# EAGLE design D1-Nixi-IN-16-V2-lapos (EAGLE 6.3)
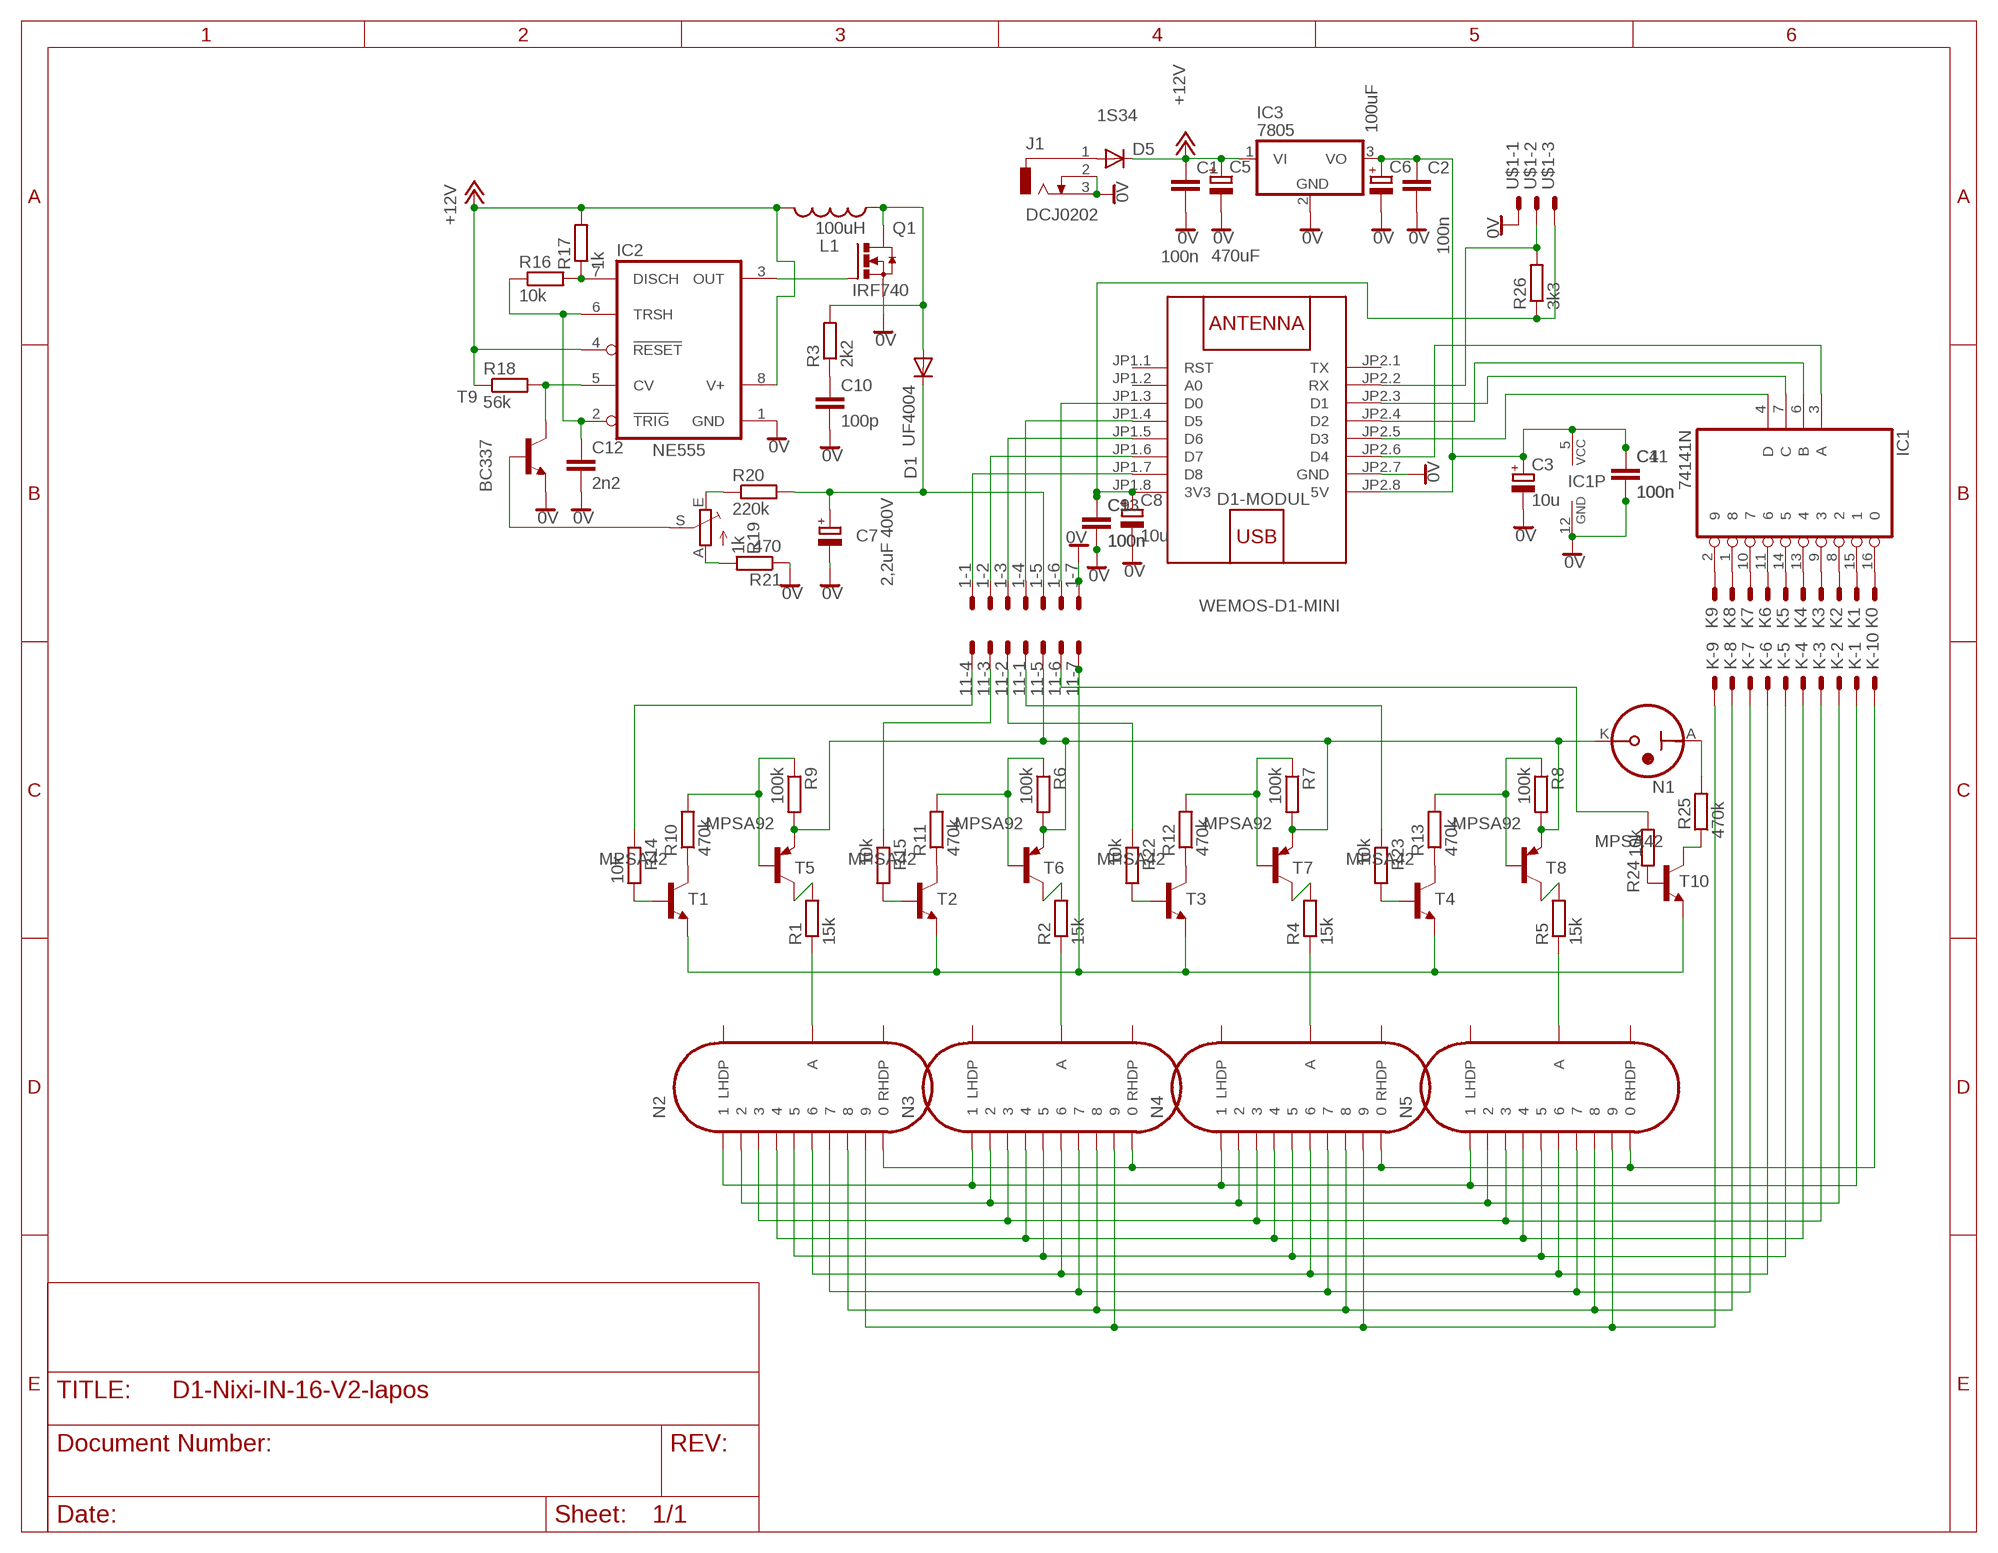
[diagram p0: schematic, sheet 1]

## Parts
1  PAD7  [PAD7]
11  PAD7  [PAD7]
C1  100n  C-EUC0603  [C0603]
C2  100n  C-EUC0603  [C0603]
C3  10u  CPOL-EUE2,5-6E  [E2,5-6E]
C4  100n  C-EUC0603  [C0603]
C5  470uF  CPOL-EUE5-10.5  [E5-10,5]
C6  100uF  CPOL-EUE5-10.5  [E5-10,5]
C7  2,2uF 400V  CPOL-EUE5-10.5  [E5-10,5]
C8  10u  CPOL-EUE2,5-6E  [E2,5-6E]
C9  100n  C-EUC0603  [C0603]
C10  100p  C-EU050-024X044  [C050-024X044]
C11  100n  C-EUC0603  [C0603]
C12  2n2  C-EUC0603  [C0603]
C13  100n  C-EUC0603  [C0603]
D1  UF4004  BA221  [DO35-10]
D1-MODUL  WEMOS-D1-MINI  [WEMOS-D1-MINI]
D5  1S34  DIODE-DO214AA  [DO214AA]
IC1  74141N  [DIL16]
IC2  NE555  ICM7555  [DIL08]
IC3  7805  7805T  [TO220H]
J1  DCJ0202  [DCJ0202]
K  PAD25  [PAD25]
K0  PAD1  [PAD1]
K1  PAD1  [PAD1]
K2  PAD1  [PAD1]
K3  PAD1  [PAD1]
K4  PAD1  [PAD1]
K5  PAD1  [PAD1]
K6  PAD1  [PAD1]
K7  PAD1  [PAD1]
K8  PAD1  [PAD1]
K9  PAD1  [PAD1]
L1  100uH  L  [6000]
N1  IN-6  [IN-6]
N2  IN-16  [IN-16]
N3  IN-16  [IN-16]
N4  IN-16  [IN-16]
N5  IN-16  [IN-16]
Q1  IRF740  IRF3704-H  [TO220BH]
R1  15k  R-EU_0207/7  [0207/7]
R2  15k  R-EU_0207/7  [0207/7]
R3  2k2  R-EU_0204/7  [0204/7]
R4  15k  R-EU_0207/7  [0207/7]
R5  15k  R-EU_0207/7  [0207/7]
R6  100k  R-EU_0207/7  [0207/7]
R7  100k  R-EU_0207/7  [0207/7]
R8  100k  R-EU_0207/7  [0207/7]
R9  100k  R-EU_0207/7  [0207/7]
R10  470k  R-EU_0207/7  [0207/7]
R11  470k  R-EU_0207/7  [0207/7]
R12  470k  R-EU_0207/7  [0207/7]
R13  470k  R-EU_0207/7  [0207/7]
R14  10k  R-EU_0207/7  [0207/7]
R15  10k  R-EU_0207/7  [0207/7]
R16  10k  R-EU_R0603  [R0603]
R17  1k  R-EU_R0603  [R0603]
R18  56k  R-EU_R0603  [R0603]
R19  1k  TRIM_EU-CA6H  [CA6H]
R20  220k  R-EU_0204/7  [0204/7]
R21  470  R-EU_0204/7  [0204/7]
R22  10k  R-EU_0207/7  [0207/7]
R23  10k  R-EU_0207/7  [0207/7]
R24  10k  R-EU_0207/7  [0207/7]
R25  470k  R-EU_0207/7  [0207/7]
R26  3k3  R-EU_R0603  [R0603]
T1  MPSA42  BC317-NPN-TO92-EBC  [TO92-EBC]
T2  MPSA42  BC317-NPN-TO92-EBC  [TO92-EBC]
T3  MPSA42  BC317-NPN-TO92-EBC  [TO92-EBC]
T4  MPSA42  BC317-NPN-TO92-EBC  [TO92-EBC]
T5  MPSA92  BC328-PNP-TO92-EBC  [TO92-EBC]
T6  MPSA92  BC328-PNP-TO92-EBC  [TO92-EBC]
T7  MPSA92  BC328-PNP-TO92-EBC  [TO92-EBC]
T8  MPSA92  BC328-PNP-TO92-EBC  [TO92-EBC]
T9  BC337  BC848-NPN-SOT23-BEC  [SOT23-BEC]
T10  MPSA42  BC317-NPN-TO92-EBC  [TO92-EBC]
U$1  PAD3  [PAD3]

## Nets
0V: 1.P$7 C1.2 C2.2 C3.- C4.2 C5.- C6.- C7.- C8.- C9.2 C10.2 C11.2 C12.2 C13.2 D1-MODUL.JP2.7(GND) IC1.12(GND) IC2.1(GND) IC3.2(GND) J1.2 J1.3 Q1.S R21.1 T9.E U$1.P$1
+12V: C1.1 C5.+ D5.C IC2.4(RESET) IC2.8(V+) IC3.1(VI) L1.1 R17.2 R18.1
GND: 11.P$7 T1.E T2.E T3.E T4.E T10.E
N$1: D1-MODUL.JP2.5(D3) IC1.4(D)
N$2: D1-MODUL.JP2.3(D1) IC1.7(C)
N$3: D1-MODUL.JP2.4(D2) IC1.6(B)
N$4: 1.P$1 D1-MODUL.JP1.7(D8)
N$5: 1.P$2 D1-MODUL.JP1.6(D7)
N$6: 1.P$3 D1-MODUL.JP1.5(D6)
N$7: 1.P$4 D1-MODUL.JP1.4(D5)
N$8: 1.P$6 D1-MODUL.JP1.3(D0)
N$10: N2.A R1.1
N$11: N3.A R2.1
N$12: N4.A R4.1
N$13: N5.A R5.1
N$14: R1.2 T5.C
N$15: R2.2 T6.C
N$16: R4.2 T7.C
N$17: R5.2 T8.C
N$18: R19.E R20.1
N$19: R10.1 T1.C
N$20: R19.A R21.2
N$21: R9.1 R10.2 T5.B
N$22: IC2.3(OUT) Q1.G
N$23: IC2.7(DISCH) R16.2 R17.1
N$24: C12.1 IC2.2(TRIG) IC2.6(TRSH) R16.1
N$25: R6.1 R11.2 T6.B
N$26: IC2.5(CV) R18.2 T9.C
N$27: C10.1 R3.1
N$28: 1.P$5 C7.+ D1.C R20.2
N$29: R7.1 R12.2 T7.B
N$30: R8.1 R13.2 T8.B
N$31: R11.1 T2.C
N$32: R12.1 T3.C
N$33: R13.1 T4.C
N$34: R14.2 T1.B
N$35: R15.2 T2.B
N$36: R22.2 T3.B
N$37: R23.2 T4.B
N$38: R24.2 T10.B
N$39: 11.P$5 N1.K R6.2 R7.2 R8.2 R9.2 T5.E T6.E T7.E T8.E
N$40: R25.1 T10.C
N$41: N1.A R25.2
N$42: K.P$10 N2.0 N3.0 N4.0 N5.0
N$44: D1.A L1.2 Q1.D R3.2
N$45: K.P$1 N2.1 N3.1 N4.1 N5.1
N$46: IC1.15 K1.1(S)
N$47: IC1.8 K2.1(S)
N$48: IC1.9 K3.1(S)
N$49: IC1.13 K4.1(S)
N$50: IC1.14 K5.1(S)
N$51: IC1.11 K6.1(S)
N$52: IC1.10 K7.1(S)
N$53: IC1.1 K8.1(S)
N$54: IC1.2 K9.1(S)
N$55: IC1.16 K0.1(S)
N$56: K.P$2 N2.2 N3.2 N4.2 N5.2
N$57: K.P$3 N2.3 N3.3 N4.3 N5.3
N$58: K.P$4 N2.4 N3.4 N4.4 N5.4
N$59: K.P$5 N2.5 N3.5 N4.5 N5.5
N$60: D5.A J1.1
N$61: K.P$6 N2.6 N3.6 N4.6 N5.6
N$62: K.P$7 N2.7 N3.7 N4.7 N5.7
N$63: K.P$8 N2.8 N3.8 N4.8 N5.8
N$64: K.P$9 N2.9 N3.9 N4.9 N5.9
N$65: 11.P$4 R14.1
N$66: 11.P$3 R15.1
N$67: 11.P$2 R22.1
N$68: 11.P$1 R23.1
N$69: 11.P$6 R24.1
N$71: C2.1 C3.+ C4.1 C6.+ C11.1 D1-MODUL.JP2.8(5V) IC1.5(VCC) IC3.3(VO)
N$78: D1-MODUL.JP2.6(D4) IC1.3(A)
N$79: C8.+ C9.1 C13.1 D1-MODUL.JP1.8(3V3) R26.1 U$1.P$3
N$80: D1-MODUL.JP2.2(RX) R26.2 U$1.P$2
N$119: R19.S T9.B
Unconnected: D1-MODUL.JP1.1(RST) D1-MODUL.JP1.2(A0) D1-MODUL.JP2.1(TX) N2.LHDP N2.RHDP N3.LHDP N3.RHDP N4.LHDP N4.RHDP N5.LHDP N5.RHDP

## Library data of the parts
1 11 = tuskesor:PAD7
C1 C2 C4 C9-C13 = resistor:C-EU: CAPACITOR, European symbol
C3 C5-C8 = resistor:CPOL-EU: POLARIZED CAPACITOR, European symbol
D1 = diode:BA221: DIODE high speed (Philips)
D1-MODUL = diy-modules:WEMOS-D1-MINI: WEMOS D1 mini: Mini Wi-Fi Board based on ESP-8266 device More details can be found here: https://www.wemos.cc/product/d1-mini.html Click here to find device on ebay.com <http://www.ebay.com/sch/wemos+d1+mini+nodemcu>
D5 = diode:DIODE-: DIODE
IC1 = 74xx-eu:74*141: BCD to decimal DECODER/DRIVER
IC2 = maxim1:ICM7555: TIMER; MF: MAXIM; MPN: ICM7555IPA+; OC_FARNELL: 9663762; OC_NEWARK: 68K4387
IC3 = linear:78*: Positive VOLTAGE REGULATOR Source: http://cache.national.com/ds/LM/LM78L05.pdf http://www.fairchildsemi.com/ds/LM/LM7805.pdf
J1 = con-jack:DCJ0202: DC POWER JACK Source: DCJ0202.pdf; OC_FARNELL: unknown; OC_NEWARK: unknown
K = tuskesor:PAD25
K0 K1-K9 = tuskesor:PAD1
L1 = adafruit:L
N1 =    nixietubes-russian:IN-6: IN-6: dual nixie bulb
N2-N5 =  russian-nixies:IN-16: IN-16: small numeric frontview nixie tube
Q1 = transistor-power:IRF3704: SMPS MOSFET HEXFET® Power MOSFET Source: http://www.irf.com/product-info/datasheets/data/irf3704.pdf
R1-R18 R20-R26 = resistor:R-EU_: RESISTOR, European symbol
R19 = pot:TRIM_EU-: POTENTIOMETER
T1-T4 T9 T10 = transistor:*-NPN-: NPN Transistror BF959 corrected 2008.03.06
T5-T8 = transistor:*-PNP-: PNP Transistror
U$1 = tuskesor:PAD3

## Board
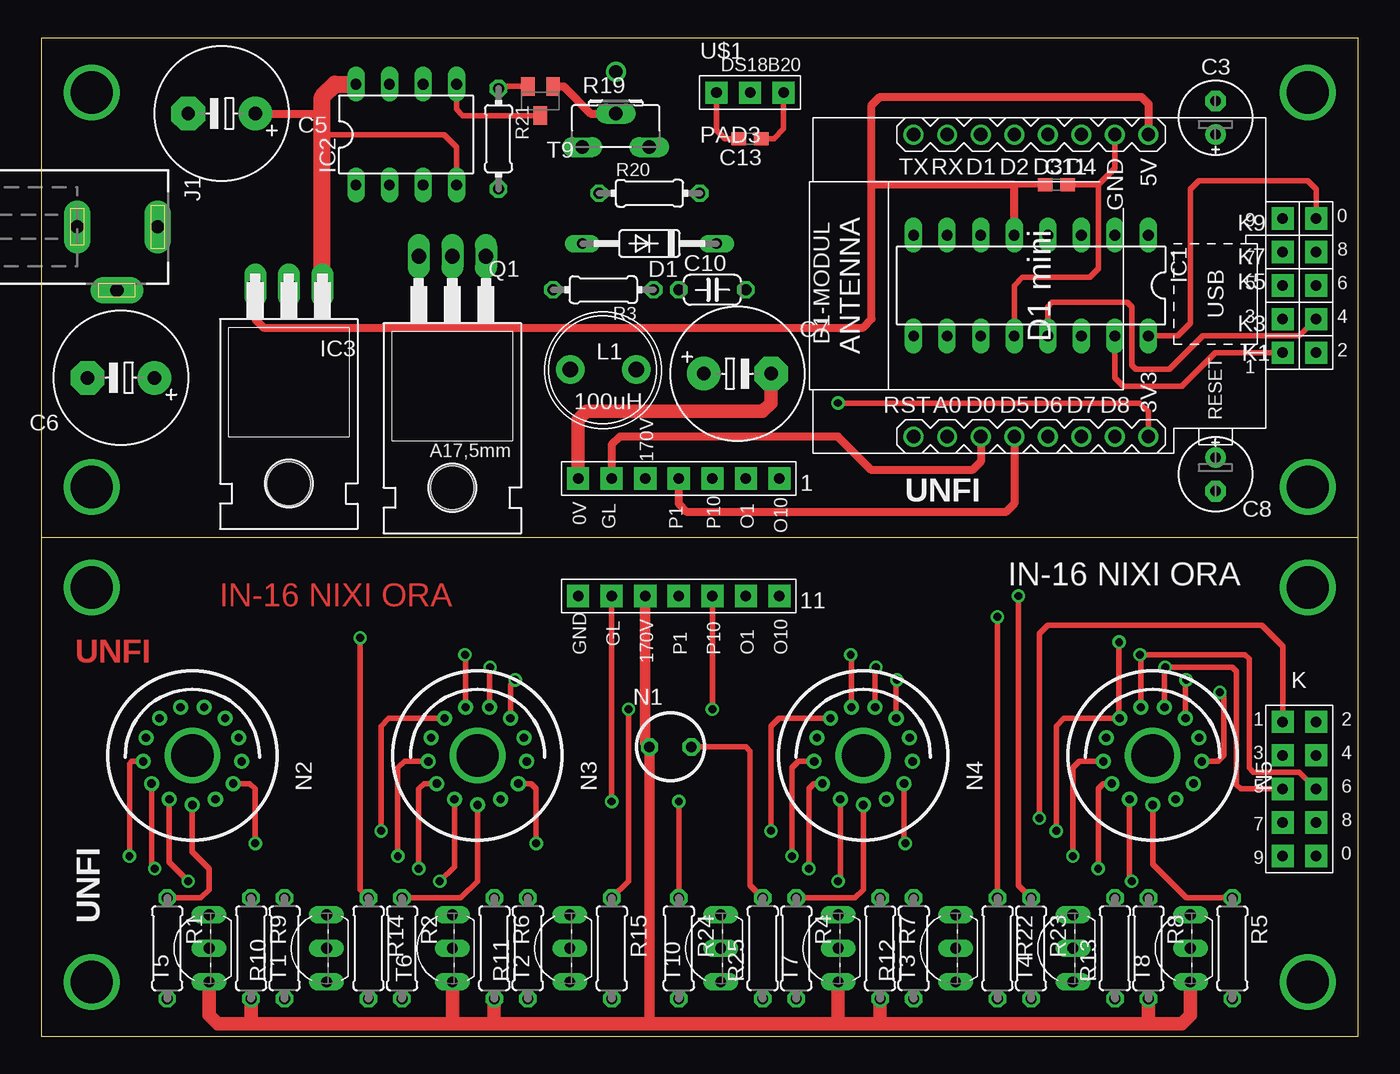
[diagram p1: board, top side]
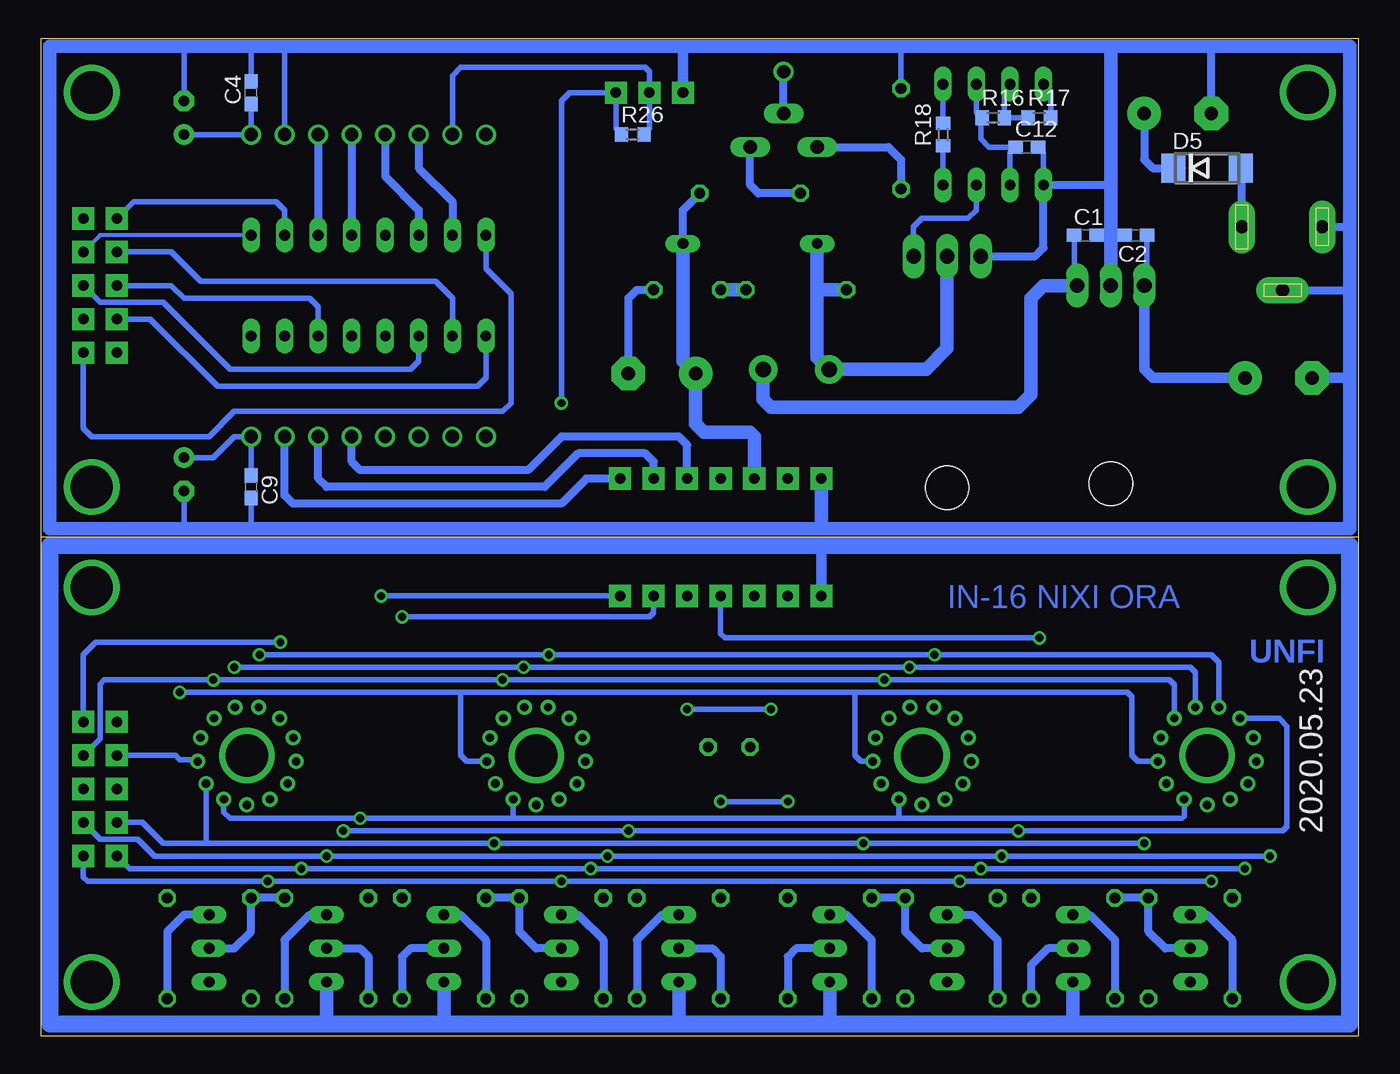
[diagram p2: board, bottom side, seen from below]

Size 99.69 x 75.56 mm. Coordinates in mm from the lower left corner, seen from the top.
Outline: 99.69,37.78 99.69,0 0,0 0,37.78
Outline: 99.69,37.78 99.69,75.56 0,75.56 0,37.78
Outline: 0,37.78 99.69,37.78
Copper layers (1*16): Top 0.035mm / dielectric 1.5mm / Bottom 0.035mm
Design rules "default": minimum track width 10mil, minimum drill 24mil, track to track 8mil, track to pad 8mil, pad to pad 8mil, via to via 8mil, smd to smd 8mil, copper to edge 40mil, drill to drill 8mil, minimum pad ring 10mil, minimum via ring 8mil, stop-mask expansion 4mil, vias tented up to drill 0mil, thermal gap 10mil

### Footprints (pad centres in the part's own frame; a part is rotated, then mirrored left to right if it is on the bottom)
PAD7 = drill 0.8 pad 1.676 square: P$1 0,0; P$2 2.54,0; P$3 5.08,0; P$4 7.62,0; P$5 10.16,0; P$6 12.7,0; P$7 15.24,0
C0603 = smd 1.1 x 1: 1 -0.85,0; 2 0.85,0
E2,5-6E = drill 0.813 pad 1.575: + -1.27,0 | drill 0.813 pad 1.575 octagon: - 1.27,0
E5-10,5 = drill 1.016 pad 2.54: + -2.54,0 | drill 1.016 pad 2.54 octagon: - 2.54,0
C050-024X044 = drill 0.813 octagon: 1 -2.54,0; 2 2.54,0
DO35-10 = drill 0.813 long: A 5.08,0; C -5.08,0
WEMOS-D1-MINI = drill 1: JP1.1 -11.43,9.525; JP1.2 -11.43,6.985; JP1.3 -11.43,4.445; JP1.4 -11.43,1.905; JP1.5 -11.43,-0.635; JP1.6 -11.43,-3.175; JP1.7 -11.43,-5.715; JP1.8 -11.43,-8.255; JP2.1 11.43,9.525; JP2.2 11.43,6.985; JP2.3 11.43,4.445; JP2.4 11.43,1.905; JP2.5 11.43,-0.635; JP2.6 11.43,-3.175; JP2.7 11.43,-5.715; JP2.8 11.43,-8.255
DO214AA = smd 1.8 x 2.2: A 2.55,0; C -2.55,0
DIL16 = drill 0.813 long: 1 -8.89,-3.81; 2 -6.35,-3.81; 3 -3.81,-3.81; 4 -1.27,-3.81; 5 1.27,-3.81; 6 3.81,-3.81; 7 6.35,-3.81; 8 8.89,-3.81; 9 8.89,3.81; 10 6.35,3.81; 11 3.81,3.81; 12 1.27,3.81; 13 -1.27,3.81; 14 -3.81,3.81; 15 -6.35,3.81; 16 -8.89,3.81
DIL08 = drill 0.813 long: 1 -3.81,-3.81; 2 -1.27,-3.81; 3 1.27,-3.81; 4 3.81,-3.81; 5 3.81,3.81; 6 1.27,3.81; 7 -1.27,3.81; 8 -3.81,3.81
TO220H = drill 1.118 long: 1 -2.54,-10.16; 2 0,-10.16; 3 2.54,-10.16 | hole 3.302: 0,4.826
DCJ0202 = drill 1 pad 2 long: 1 0,3.1; 2 4.8,0; 3 0,-3
PAD25 = drill 0.8 pad 1.676 square: P$1 0,0; P$2 0,2.54; P$3 2.54,0; P$4 2.54,2.54; P$5 5.08,0; P$6 5.08,2.54; P$7 7.62,0; P$8 7.62,2.54; P$9 10.16,0; P$10 10.16,2.54
PAD1 = drill 0.8 pad 1.676 square: 1 0,0
6000 = drill 1.2 pad 2.184: 1 -2.5,0; 2 2.5,0
IN-6 = drill 0.8 octagon: A -1.588,0; K 1.587,0
IN-16 = drill 0.63: 0 -1.745,-3.325; 1 1.745,-3.325; 2 -2.49,2.81; 3 3.727,-0.453; 4 2.49,2.81; 5 0.898,3.645; 6 -0.898,3.645; 7 3.09,-2.133; 8 -3.727,-0.453; 9 -3.09,-2.133; A 0,-3.755; LHDP -3.511,1.331; RHDP 3.511,1.331
TO220BH = drill 1.118 long: D 0,-6.35; G -2.54,-6.35; S 2.54,-6.35 | hole 3.302: 0,11.176
0207/7 = drill 0.813 octagon: 1 -3.81,0; 2 3.81,0
0204/7 = drill 0.813 octagon: 1 -3.81,0; 2 3.81,0
R0603 = smd 1 x 1.1: 1 -0.85,0; 2 0.85,0
CA6H = drill 1.016 long: A -2.54,0; E 2.54,0; S 0,2.54
TO92-EBC = drill 0.813 long: B 0,-1.27; C 2.54,-1.27; E -2.54,-1.27
SOT23-BEC = smd 1 x 1.4: B -0.95,-1.1; C 0,1.1; E 0.95,-1.1
PAD3 = drill 0.8 pad 1.676 square: P$1 0,0; P$2 2.54,0; P$3 5.08,0

### Placement (x,y rotation side)
1  55.88,42.23 180 top
11  55.88,33.34 180 top
C1  20.64,60.64 0 bottom
C2  16.83,60.64 180 bottom
C3  88.9,69.53 90 top
C4  83.82,71.44 90 bottom
C5  13.65,69.85 180 top
C6  6.03,49.85 180 top
C7  52.7,50.16 0 top
C8  88.9,42.55 270 top
C9  83.82,41.59 270 bottom
C10  50.8,56.52 0 top
C11  76.83,64.45 0 top
C12  25.08,67.31 0 bottom
C13  53.66,67.94 180 top
D1  46.04,60.01 180 top
D1-MODUL  75.56,56.83 90 top
D5  11.43,65.72 0 bottom
IC1  74.93,56.83 180 top
IC2  27.62,68.26 0 top
IC3  18.73,46.67 180 top
J1  5.71,61.28 270 top
K  93.98,23.81 270 top
K0  96.52,61.91 90 top
K1  93.98,51.75 90 top
K2  96.52,51.75 90 top
K3  93.98,54.29 90 top
K4  96.52,54.29 90 top
K5  93.98,56.83 90 top
K6  96.52,56.83 90 top
K7  93.98,59.37 90 top
K8  96.52,59.37 90 top
K9  93.98,61.91 90 top
L1  42.55,50.48 180 top
N1  47.62,21.91 180 top
N2  11.43,21.27 0 top
N3  33.02,21.27 0 top
N4  62.23,21.27 0 top
N5  84.14,21.27 0 top
Q1  31.11,52.7 180 top
R1  9.53,6.67 270 top
R2  27.3,6.67 270 top
R3  42.55,56.52 180 top
R4  57.15,6.67 270 top
R5  90.17,6.67 270 top
R6  34.29,6.67 270 top
R7  63.5,6.67 270 top
R8  83.82,6.67 270 top
R9  15.88,6.67 270 top
R10  18.41,6.67 90 top
R11  36.83,6.67 90 top
R12  66.04,6.67 90 top
R13  81.28,6.67 90 top
R14  24.77,6.67 270 top
R15  43.18,6.67 270 top
R16  27.62,69.53 0 bottom
R17  24.13,69.53 0 bottom
R18  31.43,68.26 90 bottom
R19  43.5,67.31 0 top
R20  46.04,63.82 0 top
R21  34.61,67.94 270 top
R22  72.39,6.67 270 top
R23  74.93,6.67 270 top
R24  48.26,6.67 270 top
R25  54.61,6.67 90 top
R26  54.93,68.26 0 bottom
T1  20.32,6.67 90 top
T2  38.73,6.67 90 top
T3  67.94,6.67 90 top
T4  76.83,6.67 90 top
T5  11.43,6.67 90 top
T6  29.84,6.67 90 top
T7  59.05,6.67 90 top
T8  85.72,6.67 90 top
T9  37.78,70.8 180 top
T10  50.16,6.67 90 top
U$1  51.12,71.44 0 top

### Tracks (layer width: path | path; a pad name or v marks a point on that pad's centre or on a via)
0V
  Top 0.406: IC1.12 73.66,56.83 74.3,57.47 79.38,57.47 80.01,58.1 80.01,64.45 | 80.01,64.45 81.28,65.72 D1-MODUL.JP2.7 | C11.2 80.01,64.45 | C13.2 51.75,67.95 51.12,68.58 U$1.P$1 | T9.E 34.76,71.9 R21.1
  Top 1.016: C7.- 55.24,47.94 54.61,47.31 41.27,47.31 40.64,46.67 1.P$7
  Bottom 0.406: C2.2 18.73,60.64 C1.2 | IC2.1 23.81,66.89 C12.2 | C3.- 88.9,74.93 | C4.2 83.82,74.61 84.77,74.93 | D1-MODUL.JP2.7 81.28,74.93 | C9.2 83.82,38.74 84.14,38.42 | C8.- 88.9,38.42 | R21.1 34.61,74.93
  Bottom 0.61: Q1.S 24.45,59.06 23.81,59.69 IC2.1 19.05,64.45 18.73,64.13 18.73,60.64 | C5.- 11.11,74.93 | J1.3 0.64,61.28 | J1.2 0.92,56.48 0.64,56.2 | C7.- 55.24,55.88 54.61,56.52 C10.2
  Bottom 0.813: C6.- 0.64,49.85 | 7.9,74.89 7.94,74.93 | U$1.P$1 51.12,74.93
  Bottom 1.016: 40.64,38.42 0.64,38.42 0.64,49.85 0.64,56.2 0.64,61.28 0.64,74.93 7.94,74.93 11.11,74.93 18.73,74.93 | 40.64,38.42 84.14,38.42 88.9,38.42 99.06,38.42 99.06,74.93 88.9,74.93 84.77,74.93 81.28,74.93 51.12,74.93 34.61,74.93 18.73,74.93 | 1.P$7 40.64,38.42 | IC3.2 18.73,60.64 18.73,74.93
+12V
  Top 0.406: IC2.4 31.43,67.31 30.48,68.26 21.8,68.26 | 21.8,68.26 21.48,67.95 | 21.8,68.26 21.27,68.26 | 21.48,69.85 21.48,70.92 21.27,71.12
  Top 0.61: C5.+ 21.48,69.85
  Top 1.27: IC3.1 21.27,68.26 21.27,71.12 22.23,72.07 IC2.8
  Bottom 0.406: C1.1 21.49,57.05 IC3.1 | R17.2 23.28,71.54 IC2.8 | R18.1 IC2.4
  Bottom 0.61: C5.+ 16.19,66.36 15.56,65.72 D5.C 13.34,65.72
  Bottom 1.016: L1.1 45.05,48.22 44.45,47.62 25.72,47.62 24.77,48.58 24.77,55.88 23.81,56.83 IC3.1
GND
  Bottom 0.813: 11.P$7 40.64,37.15
  Bottom 1.016: T1.E 21.59,0.95 | T2.E 40.01,0.95 | T10.E 51.44,0.95 | T3.E 69.22,0.95 | T4.E 78.11,0.95
  Bottom 1.27: 0.64,37.15 40.64,37.15 99.06,37.15 99.06,0.95 78.11,0.95 69.22,0.95 51.44,0.95 40.01,0.95 21.59,0.95 0.64,0.95 0.64,37.15
N$1
  Bottom 0.61: D1-MODUL.JP2.5 IC1.4
N$2
  Bottom 0.61: D1-MODUL.JP2.3 71.12,65.72 68.58,63.18 IC1.7
N$3
  Bottom 0.61: D1-MODUL.JP2.4 73.66,65.09 71.12,62.55 IC1.6
N$4
  Bottom 0.61: 1.P$1 58.42,42.23 60.33,40.32 80.64,40.32 81.28,40.96 D1-MODUL.JP1.7
N$5
  Bottom 0.61: 1.P$2 53.34,43.5 53.98,44.13 59.05,44.13 61.59,41.59 78.11,41.59 78.74,42.23 D1-MODUL.JP1.6
N$6
  Bottom 0.61: 1.P$3 50.8,44.77 51.44,45.4 60.33,45.4 62.87,42.86 75.56,42.86 76.2,43.5 D1-MODUL.JP1.5
N$7
  Top 0.61: D1-MODUL.JP1.4 73.66,40.32 73.03,39.69 48.9,39.69 48.26,40.32 1.P$4
N$8
  Top 0.61: D1-MODUL.JP1.3 71.12,43.5 70.48,42.86 62.87,42.86 60.33,45.4 43.81,45.4 43.18,44.77 1.P$6
N$9  (via drill 3.2)
  other vias: 84.14,21.27
N$10
  Top 0.406: N2.A 11.43,13.97 12.7,12.7 12.7,11.11 12.06,10.48 R1.1
N$11
  Top 0.406: N3.A 33.02,11.75 31.75,10.48 R2.1
N$12
  Top 0.406: R4.1 61.59,10.48 62.23,11.11 N4.A
N$13
  Top 0.406: N5.A 84.14,13.02 86.68,10.48 R5.1
N$14
  Bottom 0.61: T5.C 11.43,9.21 9.53,7.3 R1.2
N$15
  Bottom 0.61: T6.C 29.21,9.21 27.3,7.3 R2.2
N$16
  Bottom 0.61: T7.C 59.05,9.21 57.15,7.3 R4.2
N$17
  Bottom 0.61: T8.C 88.9,9.21 90.17,7.94 R5.2
N$18
  Bottom 0.61: R20.1 45.4,63.82 46.04,64.45 R19.E
N$19
  Bottom 0.61: T1.C 20.32,9.21 18.41,7.3 R10.1
N$20
  Bottom 0.61: R19.A 35.56,67.31 34.61,66.36 R21.2
N$21
  Bottom 0.61: T5.B 14.61,6.67 15.88,7.94 R9.1 R10.2
N$22
  Bottom 0.406: Q1.G 33.66,61.28 33.02,61.91 29.53,61.91 28.89,62.55 IC2.3
N$23
  Bottom 0.406: R17.1 R16.2 26.77,71.65 IC2.7
N$24
  Bottom 0.406: IC2.2 26.35,66.89 C12.1 27.94,67.31 28.57,67.95 28.57,69.43 R16.1 28.89,69.95 IC2.6
N$25
  Bottom 0.61: T6.B 33.02,6.67 34.29,7.94 R6.1 R11.2
N$26
  Top 0.406: T9.C 31.9,69.7 31.43,70.17 IC2.5
  Bottom 0.406: IC2.5 R18.2
N$27
  Bottom 1.016: C10.1 R3.1
N$28
  Bottom 0.61: D1.C 51.12,62.55 R20.2
  Bottom 1.016: D1.C 51.12,51.12 C7.+ 50.16,46.35 49.53,45.72 46.04,45.72 45.72,45.4 1.P$5
N$29
  Bottom 0.61: T7.B 62.23,6.67 63.5,7.94 R7.1 R12.2
N$30
  Bottom 0.61: R13.2 R8.1 83.82,7.94 85.09,6.67 T8.B
N$31
  Bottom 0.61: T2.C 38.73,9.21 36.83,7.3 R11.1
N$32
  Bottom 0.61: T3.C 67.94,9.21 66.04,7.3 R12.1
N$33
  Bottom 0.61: T4.C 79.38,9.21 81.28,7.3 R13.1
N$34
  Bottom 0.61: T1.B 23.5,6.67 24.77,5.4 R14.2
N$35
  Bottom 0.61: T2.B 42.55,6.67 43.18,6.03 R15.2
N$36
  Bottom 0.61: T3.B 71.75,6.67 72.39,6.03 R22.2
N$37
  Bottom 0.61: T4.B 75.56,6.67 74.93,6.03 R23.2
N$38
  Bottom 0.61: T10.B 48.9,6.67 48.26,6.03 R24.2
N$39
  Top 0.813: 11.P$5 45.72,22.23 N1.K 46.04,1.27 45.72,0.95
  Top 1.016: T5.E 12.7,1.59 13.34,0.95 15.88,0.95 | 15.88,0.95 31.11,0.95 | 31.11,0.95 34.29,0.95 | 34.29,0.95 45.72,0.95 60.33,0.95 | 60.33,0.95 63.5,0.95 | 63.5,0.95 83.82,0.95 | 83.82,0.95 86.36,0.95 87,1.59 T8.E | R8.2 83.82,0.95 | T7.E 60.33,0.95 | R7.2 63.5,0.95 | R6.2 34.29,0.95 | T6.E 31.11,0.95 | R9.2 15.88,0.95
N$40
  Bottom 0.61: T10.C 52.7,9.21 54.61,7.3 R25.1
N$41
  Top 0.406: R25.2 53.66,11.43 53.66,21.59 53.34,21.91 N1.A
N$42  (via drill 0.6)
  Top 0.406: N2.0 9.69,13.17 v11.11,11.75 | N5.0 82.39,11.9 v82.55,11.75 | N3.0 31.27,12.86 v30.16,11.75 | N4.0 60.48,11.91 v60.33,11.75
  Bottom 0.406: K.P$10 96.52,12.06 96.2,11.75 v82.55,11.75 v60.33,11.75 59.69,11.75 v30.16,11.75 v11.11,11.75 10.79,11.75
N$43  (via drill 3.2)
  other vias: 3.81,4.13
N$44
  Bottom 1.016: D1.A 40.96,56.52 | 40.96,56.52 40.96,51.4 L1.2 32.7,50.48 31.11,52.07 Q1.D | R3.2 40.96,56.52
N$45  (via drill 0.6)
  Top 0.406: K.P$1 93.98,29.53 92.39,31.11 76.2,31.11 75.56,30.48 v75.56,16.51
  Bottom 0.406: N2.1 13.18,16.67 13.34,16.51 34.92,16.51 | 34.92,16.51 63.82,16.51 | 63.82,16.51 v75.56,16.51 85.41,16.51 85.88,16.98 N5.1 | N3.1 34.77,16.67 34.92,16.51 | N4.1 63.98,16.67 63.82,16.51
N$46
  Top 0.406: K1.1 88.9,51.75 86.36,49.21 81.92,49.21 81.28,49.85 IC1.15
N$47
  Bottom 0.406: K2.1 96.52,46.04 95.89,45.4 87,45.4 85.09,47.31 64.77,47.31 64.14,47.94 64.14,56.2 66.04,58.1 IC1.8
N$48
  Bottom 0.406: IC1.9 66.04,49.85 66.67,49.21 86.36,49.21 91.44,54.29 K3.1
N$49
  Top 0.406: K4.1 95.25,53.02 87.95,53.02 85.41,50.48 82.87,50.48 82.55,50.8 82.55,55.24 82.23,55.56 76.52,55.56 76.2,55.24 IC1.13
N$50
  Bottom 0.406: IC1.14 78.74,55.24 79.38,55.88 88.9,55.88 89.85,56.83 K5.1
N$51
  Bottom 0.406: IC1.11 71.12,51.12 71.75,50.48 85.41,50.48 90.49,55.56 95.25,55.56 K6.1
N$52
  Bottom 0.406: IC1.10 68.58,55.88 69.85,57.15 87.63,57.15 89.85,59.37 K7.1
N$53
  Bottom 0.305: IC1.1 95.25,60.64 K8.1
N$54
  Bottom 0.406: K9.1 92.71,63.18 81.92,63.18 81.28,62.55 IC1.2
N$55
  Top 0.406: IC1.16 86.04,53.02 87,53.97 87,64.13 87.63,64.77 95.89,64.77 96.52,64.13 K0.1
N$56  (via drill 0.6)
  Top 0.406: N3.2 26.3,24.08 25.72,23.5 v25.72,15.56 | N4.2 55.83,24.08 55.24,23.5 v55.24,15.56 | v76.83,15.56 76.83,23.5 77.42,24.08 N5.2 81.6,24.13 v81.6,29.84
  Bottom 0.406: N2.2 5.99,24.08 5.4,23.5 5.4,15.88 5.71,15.56 v25.72,15.56 v55.24,15.56 v76.83,15.56 | K.P$2 96.52,28.89 95.57,29.84 v81.6,29.84
N$57  (via drill 0.6)
  Top 0.406: N5.3 89.08,20.82 89.53,21.27 89.53,25.72 v89.22,26.03
  Bottom 0.406: N2.3 16.69,20.82 17.14,21.27 17.14,25.72 17.46,26.03 38.1,26.03 | 38.1,26.03 67.94,26.03 | 67.94,26.03 v89.22,26.03 | N3.3 37.65,20.82 38.1,21.27 38.1,26.03 | N4.3 67.49,20.82 67.94,21.27 67.94,26.03 | K.P$3 89.53,21.27 89.22,20.95 88,20.95 N5.3
N$58  (via drill 0.6)
  Top 0.406: N3.4 35.51,26.62 v35.88,26.99 | N4.4 64.72,26.94 v64.77,26.99 | N5.4 86.63,26.94 v86.68,26.99
  Bottom 0.406: N2.4 13.92,26.62 14.29,26.99 v35.88,26.99 v64.77,26.99 v86.68,26.99 87.95,26.99 94.93,26.99 95.25,26.67 95.25,22.54 K.P$4
N$59  (via drill 0.6)
  Top 0.406: N3.5 33.92,27.89 v33.97,27.94 | N4.5 63.13,27.89 v63.18,27.94 | N5.5 85.04,27.89 v85.09,27.94 90.17,27.94 90.49,27.62 90.49,19.05 90.81,18.73 K.P$5
  Bottom 0.406: N2.5 12.33,27.57 12.7,27.94 v33.97,27.94 v63.18,27.94 83.82,27.94 84.45,27.94 v85.09,27.94
N$60
  Bottom 0.61: J1.1 8.81,65.66 D5.A
N$61  (via drill 0.6)
  Top 0.406: N3.6 32.12,28.84 v32.07,28.89 | N4.6 61.33,28.84 v61.28,28.89 | N5.6 83.24,28.84 v83.19,28.89 91.12,28.89 91.44,28.58 91.44,20.32 91.76,20 95.25,20 K.P$6
  Bottom 0.406: N2.6 10.53,28.31 11.11,28.89 v32.07,28.89 v61.28,28.89 80.96,28.89 82.23,28.89 v83.19,28.89
N$62  (via drill 0.6)
  Top 0.406: N2.7 15.79,19.14 16.19,18.73 v16.19,14.61 | N3.7 37.06,19.14 37.47,18.73 v37.47,14.61 | N4.7 65.32,14.69 v65.41,14.61
  Bottom 0.406: K.P$7 92.08,16.19 90.49,14.61 87.31,14.61 | 87.31,14.61 v65.41,14.61 v37.47,14.61 v16.19,14.61 | N5.7 87.23,14.69 87.31,14.61
N$63  (via drill 0.6)
  Top 0.406: N2.8 6.85,20.82 6.67,20.64 v6.67,13.65 | N5.8 78.61,20.82 78.11,20.32 v78.11,13.65 | N3.8 27.49,20.82 26.99,20.32 v26.99,13.65 | N4.8 57.33,20.82 56.83,20.32 v56.83,13.65
  Bottom 0.406: K.P$8 95.25,14.92 92.39,14.92 91.12,13.65 v78.11,13.65 v56.83,13.65 55.56,13.65 v26.99,13.65 v6.67,13.65
N$64  (via drill 0.6)
  Top 0.406: N2.9 8.34,12.93 v8.57,12.7 | N5.9 80.42,19.14 80.01,18.73 v80.01,12.7 | N3.9 28.98,19.14 28.57,18.73 v28.57,12.7 | N4.9 58.51,19.14 58.1,18.73 v58.1,12.7
  Bottom 0.406: K.P$9 93.03,12.7 v80.01,12.7 58.74,12.7 v58.1,12.7 v28.57,12.7 v8.57,12.7
N$65  (via drill 0.6)
  Top 0.406: v24.13,30.16 24.13,11.11 R14.1
  Bottom 0.406: 11.P$4 48.26,30.48 47.94,30.16 v24.13,30.16
N$66  (via drill 0.6)
  Top 0.406: R15.1 44.45,11.75 v44.45,24.76 | v50.8,24.76 11.P$3
  Bottom 0.406: v44.45,24.76 v50.8,24.76
N$67  (via drill 0.6)
  Top 0.406: v72.39,31.75 R22.1
  Bottom 0.406: 11.P$2 53.34,32.07 53.66,31.75 v72.39,31.75
N$68  (via drill 0.6)
  Top 0.406: v73.98,33.34 73.98,11.43 R23.1
  Bottom 0.406: 11.P$1 v73.98,33.34
N$69  (via drill 0.6)
  Top 0.406: 11.P$6 v43.18,17.78 | v48.26,17.78 R24.1
  Bottom 0.406: v43.18,17.78 v48.26,17.78
N$70  (via drill 3.2)
  other vias: 95.89,41.59
N$71
  Top 0.406: C11.1 73.66,64.45
  Top 0.61: D1-MODUL.JP2.8 C4.1 83.29,71.12 63.5,71.12 62.87,70.49 62.87,64.45 | IC3.3 16.19,54.29 16.83,53.66 62.23,53.66 62.87,54.29 62.87,64.45 | IC1.5 73.66,64.45 62.87,64.45
  Bottom 0.406: C4.1 D1-MODUL.JP2.8 C3.+ | C2.1 15.98,57.05 IC3.3
  Bottom 0.813: C6.+ 15.56,49.85 16.19,50.48 IC3.3
N$72  (via drill 3.2)
  other vias: 95.89,4.13
N$73  (via drill 3.2)
  other vias: 95.89,33.97
N$74  (via drill 3.2)
  other vias: 3.81,33.97
N$75  (via drill 3.2)
  other vias: 3.81,41.59
N$76  (via drill 3.2)
  other vias: 3.81,71.44
N$77  (via drill 3.2)
  other vias: 95.89,71.44
N$78
  Bottom 0.61: D1-MODUL.JP2.6 IC1.3
N$79  (via drill 0.6)
  Top 0.406: v60.33,47.94 83.19,47.94 83.82,47.31 D1-MODUL.JP1.8 | C13.1 55.46,67.95 56.2,68.68 U$1.P$3
  Bottom 0.406: C9.1 D1-MODUL.JP1.8 85.09,45.4 86.68,43.81 C8.+ | v60.33,47.94 60.33,70.8 59.69,71.44 U$1.P$3 56.2,68.68 R26.1
N$80
  Bottom 0.406: D1-MODUL.JP2.2 68.58,72.71 67.94,73.34 53.98,73.34 53.66,73.02 U$1.P$2 53.66,68.68 R26.2
N$81  (via drill 3.2)
  other vias: 62.23,21.27
N$82  (via drill 3.2)
  other vias: 33.02,21.27
N$83  (via drill 3.2)
  other vias: 11.43,21.27
N$119  (via drill 1)
  Top 0.61: T9.B 39.54,71.9 41.59,69.85 R19.S
  Bottom 0.61: R19.S v43.5,73.02

### Text on the board
Top: IN-16 NIXI ORA | UNFI
Bottom: IN-16 NIXI ORA | UNFI
tPlace: DS18B20 | 0 | 9 | 7 | 8 | 5 | 6 | 3 | 4 | 2 | 1 | 170V | UNFI | 0V | GL | P1 | P10 | O1 | O10 | IN-16 NIXI ORA | GL | GND | P1 | P10 | O1 | O10 | 170V | 1 | 2 | 3 | 4 | 5 | 6 | 7 | 8 | 0 | 9 | UNFI
bPlace: 2020.05.23